# EAGLE schematic AS3364 DG412 bus mixer v1.0 (EAGLE 9.6.2)
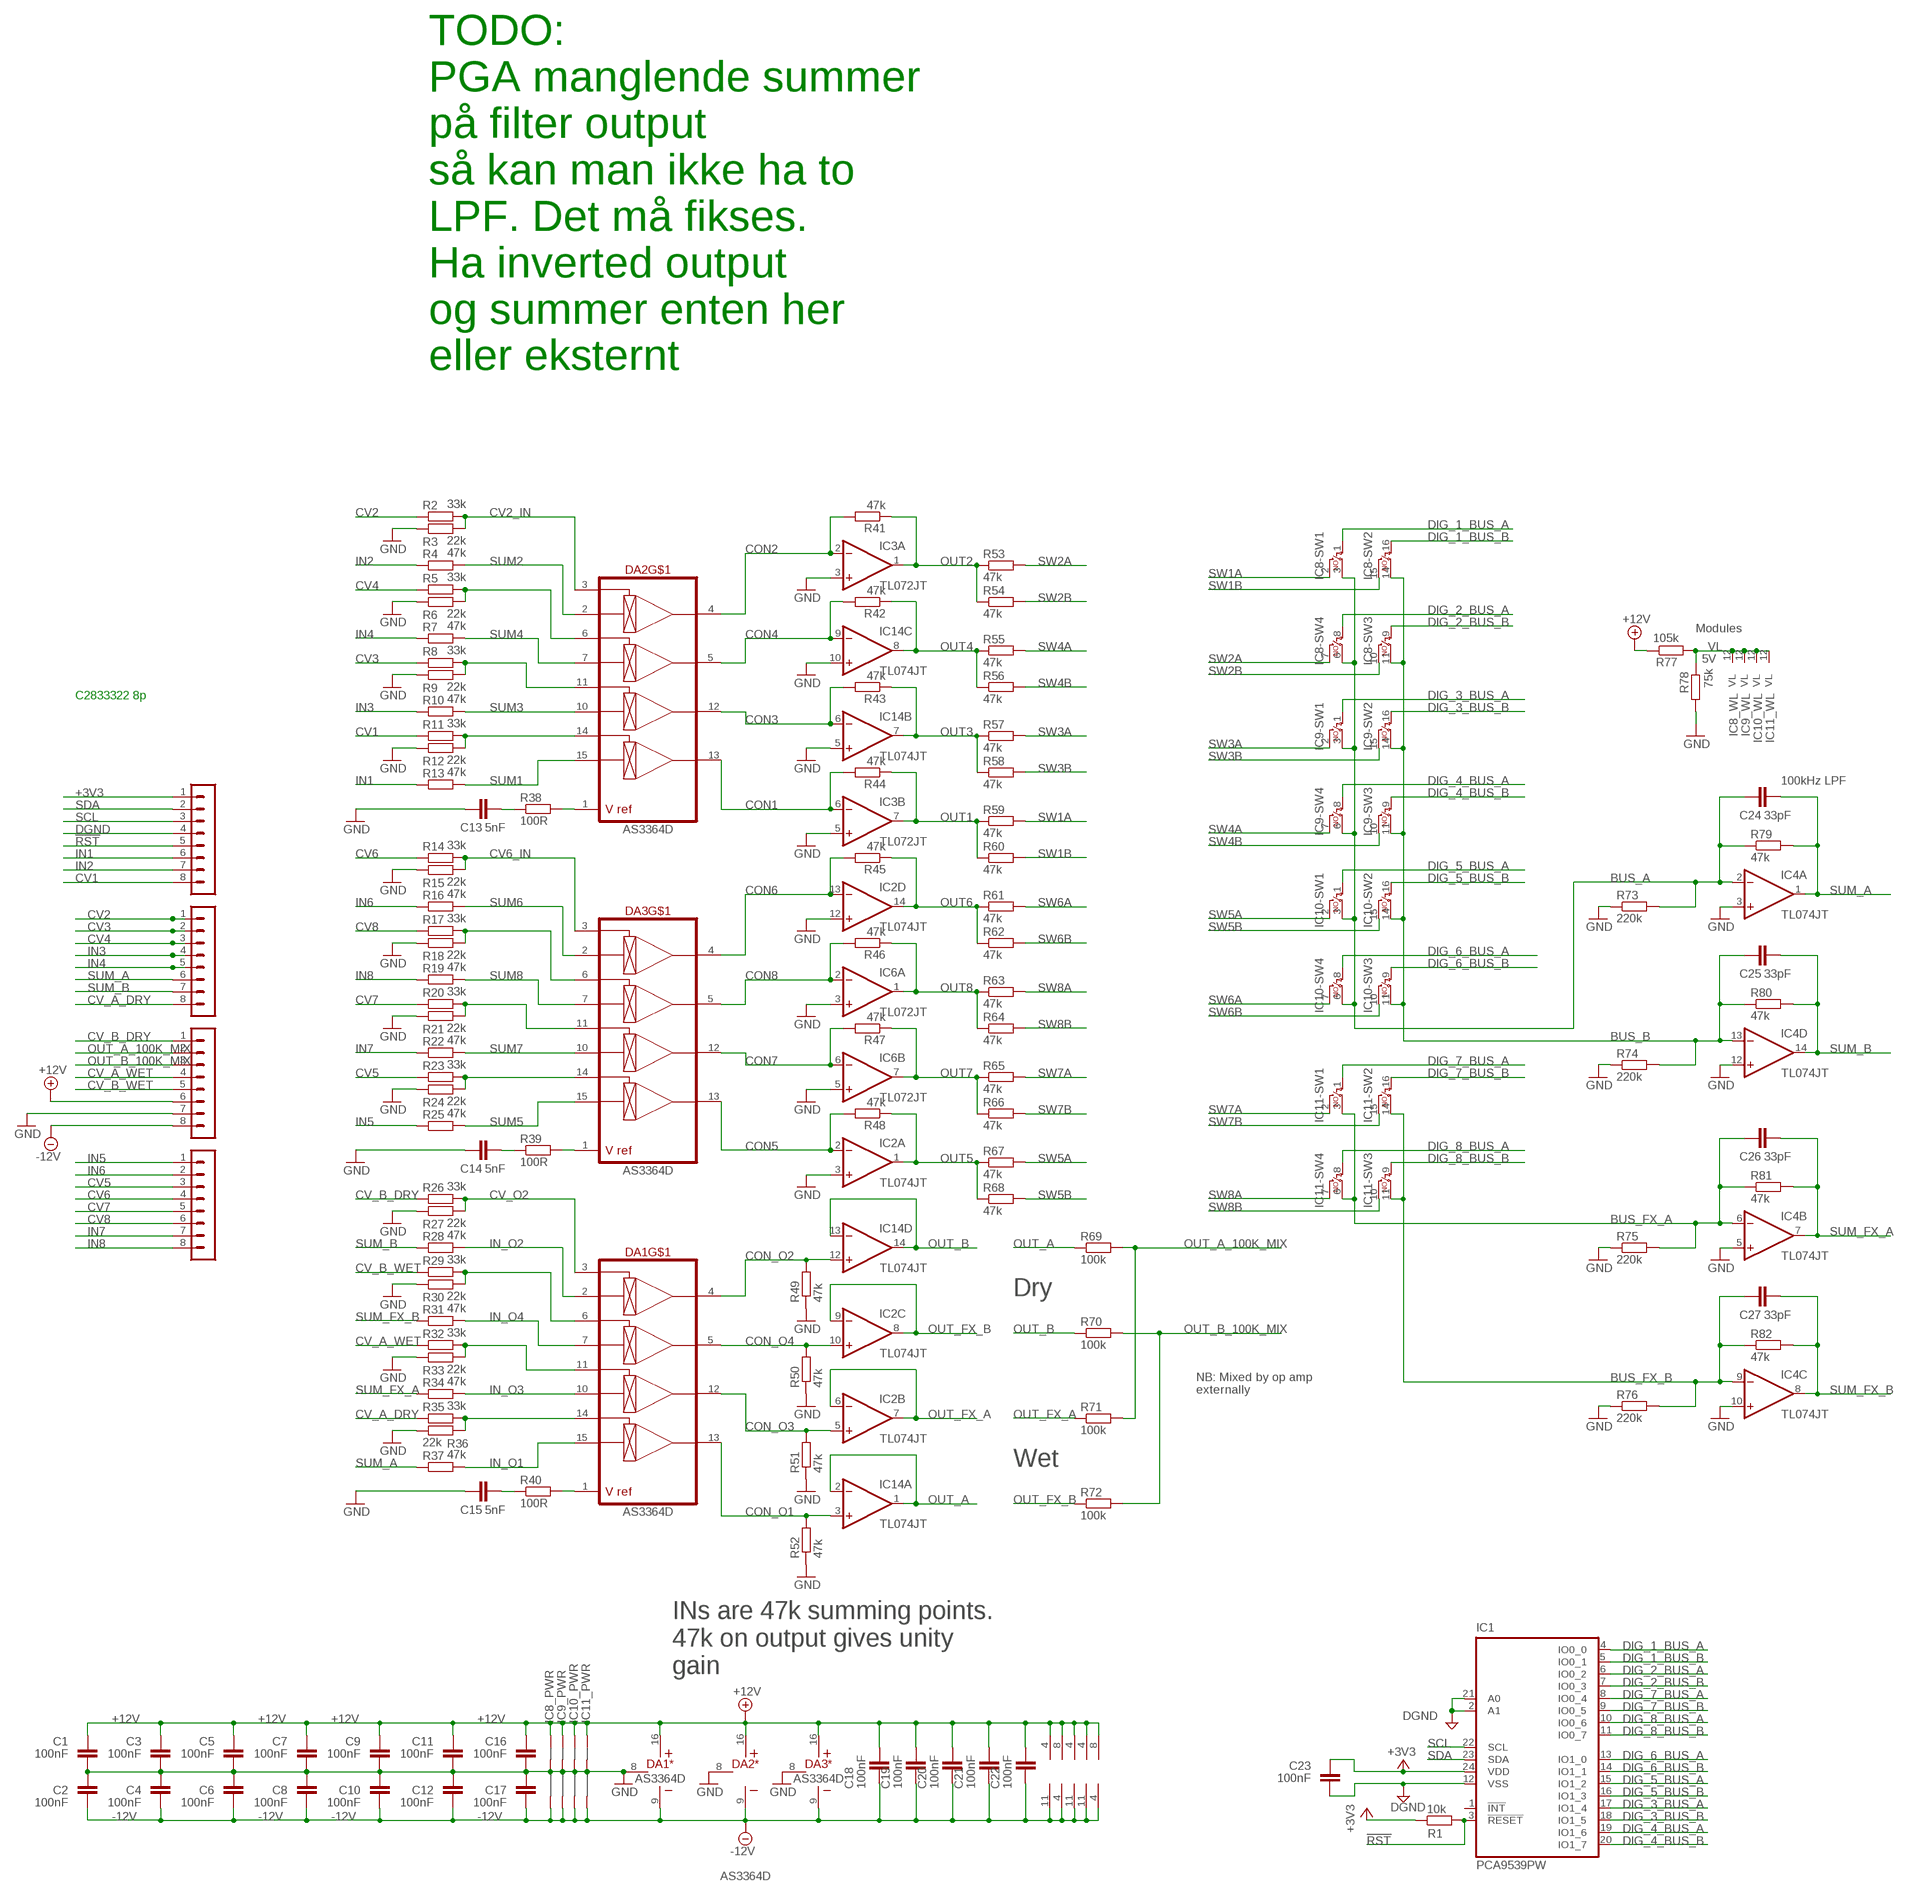
[diagram p0: schematic, sheet 1]

## Parts
C1  100nF  C-EUC0402  [C0402]
C2  100nF  C-EUC0402  [C0402]
C3  100nF  C-EUC0402  [C0402]
C4  100nF  C-EUC0402  [C0402]
C5  100nF  C-EUC0402  [C0402]
C6  100nF  C-EUC0402  [C0402]
C7  100nF  C-EUC0402  [C0402]
C8  100nF  C-EUC0402  [C0402]
C9  100nF  C-EUC0402  [C0402]
C10  100nF  C-EUC0402  [C0402]
C11  100nF  C-EUC0402  [C0402]
C12  100nF  C-EUC0402  [C0402]
C13  5nF  C-EU-J  [R0402]
C14  5nF  C-EU-J  [R0402]
C15  5nF  C-EU-J  [R0402]
C16  100nF  C-EUC0402  [C0402]
C17  100nF  C-EUC0402  [C0402]
C18  100nF  C-EUC0402  [C0402]
C19  100nF  C-EUC0402  [C0402]
C20  100nF  C-EUC0402  [C0402]
C21  100nF  C-EUC0402  [C0402]
C22  100nF  C-EUC0402  [C0402]
C23  100nF  C-EUC0402  [C0402]
C24  33pF  C-EU-J  [R0402]
C25  33pF  C-EU-J  [R0402]
C26  33pF  C-EU-J  [R0402]
C27  33pF  C-EU-J  [R0402]
DA1  AS3364D  [DIL16J]
DA2  AS3364D  [DIL16J]
DA3  AS3364D  [DIL16J]
IC1  PCA9539PW  [TSSOP24J]
IC2  TL074JT  [TSSOP14J]
IC3  TL072JT  [TSSOP8J]
IC4  TL074JT  [TSSOP14J]
IC6  TL072JT  [TSSOP8J]
IC8  DG412-J  [DIL16J]
IC9  DG412-J  [DIL16J]
IC10  DG412-J  [DIL16J]
IC11  DG412-J  [DIL16J]
IC14  TL074JT  [TSSOP14J]
R1  10k  R-EU_R0402  [R0402]
R2  33k  R-EU_R0402  [R0402]
R3  22k  R-EU_R0402  [R0402]
R4  47k  R-EU_R0402  [R0402]
R5  33k  R-EU_R0402  [R0402]
R6  22k  R-EU_R0402  [R0402]
R7  47k  R-EU_R0402  [R0402]
R8  33k  R-EU_R0402  [R0402]
R9  22k  R-EU_R0402  [R0402]
R10  47k  R-EU_R0402  [R0402]
R11  33k  R-EU_R0402  [R0402]
R12  22k  R-EU_R0402  [R0402]
R13  47k  R-EU_R0402  [R0402]
R14  33k  R-EU_R0402  [R0402]
R15  22k  R-EU_R0402  [R0402]
R16  47k  R-EU_R0402  [R0402]
R17  33k  R-EU_R0402  [R0402]
R18  22k  R-EU_R0402  [R0402]
R19  47k  R-EU_R0402  [R0402]
R20  33k  R-EU_R0402  [R0402]
R21  22k  R-EU_R0402  [R0402]
R22  47k  R-EU_R0402  [R0402]
R23  33k  R-EU_R0402  [R0402]
R24  22k  R-EU_R0402  [R0402]
R25  47k  R-EU_R0402  [R0402]
R26  33k  R-EU_R0402  [R0402]
R27  22k  R-EU_R0402  [R0402]
R28  47k  R-EU_R0402  [R0402]
R29  33k  R-EU_R0402  [R0402]
R30  22k  R-EU_R0402  [R0402]
R31  47k  R-EU_R0402  [R0402]
R32  33k  R-EU_R0402  [R0402]
R33  22k  R-EU_R0402  [R0402]
R34  47k  R-EU_R0402  [R0402]
R35  33k  R-EU_R0402  [R0402]
R36  22k  R-EU_R0402  [R0402]
R37  47k  R-EU_R0402  [R0402]
R38  100R  R-EU_R0402  [R0402]
R39  100R  R-EU_R0402  [R0402]
R40  100R  R-EU_R0402  [R0402]
R41  47k  R-EU_R0402  [R0402]
R42  47k  R-EU_R0402  [R0402]
R43  47k  R-EU_R0402  [R0402]
R44  47k  R-EU_R0402  [R0402]
R45  47k  R-EU_R0402  [R0402]
R46  47k  R-EU_R0402  [R0402]
R47  47k  R-EU_R0402  [R0402]
R48  47k  R-EU_R0402  [R0402]
R49  47k  R-EU_R0402  [R0402]
R50  47k  R-EU_R0402  [R0402]
R51  47k  R-EU_R0402  [R0402]
R52  47k  R-EU_R0402  [R0402]
R53  47k  R-EU_R0402  [R0402]
R54  47k  R-EU_R0402  [R0402]
R55  47k  R-EU_R0402  [R0402]
R56  47k  R-EU_R0402  [R0402]
R57  47k  R-EU_R0402  [R0402]
R58  47k  R-EU_R0402  [R0402]
R59  47k  R-EU_R0402  [R0402]
R60  47k  R-EU_R0402  [R0402]
R61  47k  R-EU_R0402  [R0402]
R62  47k  R-EU_R0402  [R0402]
R63  47k  R-EU_R0402  [R0402]
R64  47k  R-EU_R0402  [R0402]
R65  47k  R-EU_R0402  [R0402]
R66  47k  R-EU_R0402  [R0402]
R67  47k  R-EU_R0402  [R0402]
R68  47k  R-EU_R0402  [R0402]
R69  100k  R-EU_R0402  [R0402]
R70  100k  R-EU_R0402  [R0402]
R71  100k  R-EU_R0402  [R0402]
R72  100k  R-EU_R0402  [R0402]
R73  220k  R-EU_R0402  [R0402]
R74  220k  R-EU_R0402  [R0402]
R75  220k  R-EU_R0402  [R0402]
R76  220k  R-EU_R0402  [R0402]
R77  105k  R-EU_R0402  [R0402]
R78  75k  R-EU_R0402  [R0402]
R79  47k  R-EU_R0402  [R0402]
R80  47k  R-EU_R0402  [R0402]
R81  47k  R-EU_R0402  [R0402]
R82  47k  R-EU_R0402  [R0402]
SV1  MA08-1JP  [SIP-PIN08-1J]
SV3  MA08-1JP  [SIP-PIN08-1J]
SV4  MA08-1JP  [SIP-PIN08-1J]
SV33  MA08-1JP  [SIP-PIN08-1J]

## Nets
!RST: IC1.3(!RESET) R1.2 SV33.5
+3V3: C23.2 IC1.24(VDD) R1.1 SV33.1
+12V: C1.2 C3.2 C5.2 C7.2 C9.2 C11.2 C16.2 C18.2 C19.2 C20.2 C21.2 C22.2 DA1.16(*:V+) DA2.16(*:V+) DA3.16(*:V+) IC2.4(P:V+) IC3.8(P:V+) IC4.4(P:V+) IC6.8(P:V+) IC8.13(_PWR:+15V) IC9.13(_PWR:+15V) IC10.13(_PWR:+15V) IC11.13(_PWR:+15V) IC14.4(P:V+) R77.1 SV4.6
-12V: C2.1 C4.1 C6.1 C8.1 C10.1 C12.1 C17.1 C18.1 C19.1 C20.1 C21.1 C22.1 DA1.9(*:V-) DA2.9(*:V-) DA3.9(*:V-) IC2.11(P:V-) IC3.4(P:V-) IC4.11(P:V-) IC6.4(P:V-) IC8.4(_PWR:-15V) IC9.4(_PWR:-15V) IC10.4(_PWR:-15V) IC11.4(_PWR:-15V) IC14.11(P:V-) SV4.8
BUS_A: C24.1 IC4.2(A:-IN) IC8.3(-SW1:S) IC8.6(-SW4:S) IC9.3(-SW1:S) IC9.6(-SW4:S) IC10.3(-SW1:S) IC10.6(-SW4:S) R73.2 R79.1
BUS_B: C25.1 IC4.13(D:-IN) IC8.11(-SW3:S) IC8.14(-SW2:S) IC9.11(-SW3:S) IC9.14(-SW2:S) IC10.11(-SW3:S) IC10.14(-SW2:S) R74.2 R80.1
BUS_FX_A: C26.1 IC4.6(B:-IN) IC11.3(-SW1:S) IC11.6(-SW4:S) R75.2 R81.1
BUS_FX_B: C27.1 IC4.9(C:-IN) IC11.11(-SW3:S) IC11.14(-SW2:S) R76.2 R82.1
CON1: DA2.13(OUT4) IC3.6(B:-IN) R44.2
CON2: DA2.4(OUT1) IC3.2(A:-IN) R41.2
CON3: DA2.12(OUT3) IC14.6(B:-IN) R43.2
CON4: DA2.5(OUT2) IC14.9(C:-IN) R42.2
CON5: DA3.13(OUT4) IC2.2(A:-IN) R48.2
CON6: DA3.4(OUT1) IC2.13(D:-IN) R45.2
CON7: DA3.12(OUT3) IC6.6(B:-IN) R47.2
CON8: DA3.5(OUT2) IC6.2(A:-IN) R46.2
CON_O1: DA1.13(OUT4) IC14.3(A:+IN) R52.2
CON_O2: DA1.4(OUT1) IC14.12(D:+IN) R49.2
CON_O3: DA1.12(OUT3) IC2.5(B:+IN) R51.2
CON_O4: DA1.5(OUT2) IC2.10(C:+IN) R50.2
CV1: R11.1 SV33.8
CV2: R2.1 SV1.1
CV2_IN: DA2.3(CV1) R2.2 R3.2
CV3: R8.1 SV1.2
CV4: R5.1 SV1.3
CV5: R23.1 SV3.3
CV6: R14.1 SV3.4
CV6_IN: DA3.3(CV1) R14.2 R15.2
CV7: R20.1 SV3.5
CV8: R17.1 SV3.6
CV_A_DRY: R35.1 SV1.8
CV_A_WET: R32.1 SV4.4
CV_B_DRY: R26.1 SV4.1
CV_B_WET: R29.1 SV4.5
CV_O2: DA1.3(CV1) R26.2 R27.2
DGND: C23.1 IC1.2(A1) IC1.12(VSS) IC1.21(A0) SV33.4
DIG_1_BUS_A: IC1.4(IO0_0) IC8.1(-SW1:C)
DIG_1_BUS_B: IC1.5(IO0_1) IC8.16(-SW2:C)
DIG_2_BUS_A: IC1.6(IO0_2) IC8.8(-SW4:C)
DIG_2_BUS_B: IC1.7(IO0_3) IC8.9(-SW3:C)
DIG_3_BUS_A: IC1.17(IO1_4) IC9.1(-SW1:C)
DIG_3_BUS_B: IC1.18(IO1_5) IC9.16(-SW2:C)
DIG_4_BUS_A: IC1.19(IO1_6) IC9.8(-SW4:C)
DIG_4_BUS_B: IC1.20(IO1_7) IC9.9(-SW3:C)
DIG_5_BUS_A: IC1.15(IO1_2) IC10.1(-SW1:C)
DIG_5_BUS_B: IC1.16(IO1_3) IC10.16(-SW2:C)
DIG_6_BUS_A: IC1.13(IO1_0) IC10.8(-SW4:C)
DIG_6_BUS_B: IC1.14(IO1_1) IC10.9(-SW3:C)
DIG_7_BUS_A: IC1.8(IO0_4) IC11.1(-SW1:C)
DIG_7_BUS_B: IC1.9(IO0_5) IC11.16(-SW2:C)
DIG_8_BUS_A: IC1.10(IO0_6) IC11.8(-SW4:C)
DIG_8_BUS_B: IC1.11(IO0_7) IC11.9(-SW3:C)
GND: C1.1 C2.2 C3.1 C4.2 C5.1 C6.2 C7.1 C8.2 C9.1 C10.2 C11.1 C12.2 C13.1 C14.1 C15.1 C16.1 C17.2 DA1.8(*:GND) DA2.8(*:GND) DA3.8(*:GND) IC2.3(A:+IN) IC2.12(D:+IN) IC3.3(A:+IN) IC3.5(B:+IN) IC4.3(A:+IN) IC4.5(B:+IN) IC4.10(C:+IN) IC4.12(D:+IN) IC6.3(A:+IN) IC6.5(B:+IN) IC8.5(_PWR:AGND) IC9.5(_PWR:AGND) IC10.5(_PWR:AGND) IC11.5(_PWR:AGND) IC14.5(B:+IN) IC14.10(C:+IN) R3.1 R6.1 R9.1 R12.1 R15.1 R18.1 R21.1 R24.1 R27.1 R30.1 R33.1 R36.1 R49.1 R50.1 R51.1 R52.1 R73.1 R74.1 R75.1 R76.1 R78.2 SV4.7
IN1: R13.1 SV33.6
IN2: R4.1 SV33.7
IN3: R10.1 SV1.4
IN4: R7.1 SV1.5
IN5: R25.1 SV3.1
IN6: R16.1 SV3.2
IN7: R22.1 SV3.7
IN8: R19.1 SV3.8
IN_O1: DA1.15(IN4) R37.2
IN_O2: DA1.2(IN1) R28.2
IN_O3: DA1.10(IN3) R34.2
IN_O4: DA1.7(IN2) R31.2
N$1: DA3.1(VREF) R39.2
N$2: DA2.1(VREF) R38.2
N$3: DA3.6(CV2) R17.2 R18.2
N$5: DA3.11(CV3) R20.2 R21.2
N$7: DA3.14(CV4) R23.2 R24.2
N$8: C14.2 R39.1
N$9: DA1.1(VREF) R40.2
N$10: DA2.6(CV2) R5.2 R6.2
N$11: DA1.6(CV2) R29.2 R30.2
N$12: DA2.11(CV3) R8.2 R9.2
N$13: DA1.11(CV3) R32.2 R33.2
N$14: C13.2 R38.1
N$15: DA1.14(CV4) R35.2 R36.2
N$16: C15.2 R40.1
N$21: DA2.14(CV4) R11.2 R12.2
OUT1: IC3.7(B:OUT) R44.1 R59.1 R60.1
OUT2: IC3.1(A:OUT) R41.1 R53.1 R54.1
OUT3: IC14.7(B:OUT) R43.1 R57.1 R58.1
OUT4: IC14.8(C:OUT) R42.1 R55.1 R56.1
OUT5: IC2.1(A:OUT) R48.1 R67.1 R68.1
OUT6: IC2.14(D:OUT) R45.1 R61.1 R62.1
OUT7: IC6.7(B:OUT) R47.1 R65.1 R66.1
OUT8: IC6.1(A:OUT) R46.1 R63.1 R64.1
OUT_A: IC14.1(A:OUT) IC14.2(A:-IN) R69.1
OUT_A_100K_MIX: R69.2 R71.2 SV4.2
OUT_B: IC14.13(D:-IN) IC14.14(D:OUT) R70.1
OUT_B_100K_MIX: R70.2 R72.2 SV4.3
OUT_FX_A: IC2.6(B:-IN) IC2.7(B:OUT) R71.1
OUT_FX_B: IC2.8(C:OUT) IC2.9(C:-IN) R72.1
SCL: IC1.22(SCL) SV33.3
SDA: IC1.23(SDA) SV33.2
SUM1: DA2.15(IN4) R13.2
SUM2: DA2.2(IN1) R4.2
SUM3: DA2.10(IN3) R10.2
SUM4: DA2.7(IN2) R7.2
SUM5: DA3.15(IN4) R25.2
SUM6: DA3.2(IN1) R16.2
SUM7: DA3.10(IN3) R22.2
SUM8: DA3.7(IN2) R19.2
SUM_A: C24.2 IC4.1(A:OUT) R37.1 R79.2 SV1.6
SUM_B: C25.2 IC4.14(D:OUT) R28.1 R80.2 SV1.7
SUM_FX_A: C26.2 IC4.7(B:OUT) R34.1 R81.2
SUM_FX_B: C27.2 IC4.8(C:OUT) R31.1 R82.2
SW1A: IC8.2(-SW1:D) R59.2
SW1B: IC8.15(-SW2:D) R60.2
SW2A: IC8.7(-SW4:D) R53.2
SW2B: IC8.10(-SW3:D) R54.2
SW3A: IC9.2(-SW1:D) R57.2
SW3B: IC9.15(-SW2:D) R58.2
SW4A: IC9.7(-SW4:D) R55.2
SW4B: IC9.10(-SW3:D) R56.2
SW5A: IC10.2(-SW1:D) R67.2
SW5B: IC10.15(-SW2:D) R68.2
SW6A: IC10.7(-SW4:D) R61.2
SW6B: IC10.10(-SW3:D) R62.2
SW7A: IC11.2(-SW1:D) R65.2
SW7B: IC11.15(-SW2:D) R66.2
SW8A: IC11.7(-SW4:D) R63.2
SW8B: IC11.10(-SW3:D) R64.2
VL: IC8.12(_WL:VL) IC9.12(_WL:VL) IC10.12(_WL:VL) IC11.12(_WL:VL) R77.2 R78.1
Unconnected: IC1.1(!INT)

## Notes on the sheet
- TODO:
  PGA manglende summer
  på filter output
  så kan man ikke ha to
  LPF. Det må fikses.
  Ha inverted output 
  og summer enten her
  eller eksternt
- Modules
- 5V
- C2833322 8p
- 100kHz LPF
- Dry
- NB: Mixed by op amp
  externally
- Wet
- INs are 47k summing points.
  47k on output gives unity
  gain

## Library data of the parts
C1-C12 C16-C23 = rcl:C-EU: CAPACITOR, European symbol; SPICEPREFIX: C
C13-C15 C24-C27 = joakim:C-EU-J: CAPACITOR, European symbol
DA1-DA3 = joakim:AS3364: AS3364 quad linear VCA, CEM3360 style. CV is 0 to 2V Vcc-Vee = 26V max, so +/-12V or +15V/-9V
IC1 = joakim:PCA9539: 16ch i/o expander. RPW version resets only internal statemachine to get out of stuck i2c-bus, other versions also reset outputs. Interrupt output requires external pull-up resistor for all variants. https://www.nxp.com/docs/en/data-sheet/PCA9539_PCA9539R.pdf
IC2 IC4 IC14 = joakim:TL074J: OP AMP
IC3 IC6 = joakim:TL072J: OP AMP
IC8-IC11 = joakim:DG412-J: Quad switch, normally open
R1-R82 = rcl:R-EU_: RESISTOR, European symbol; SPICEPREFIX: R
SV1 SV3 SV4 SV33 = joakim:MA08-1J: PIN HEADER